# Altium schematic sheet BBB_Supply_2.SchDoc
size OrCAD A
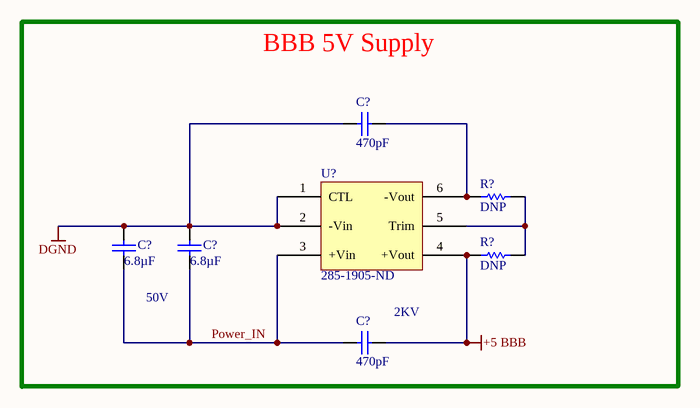
[diagram p0: BBB_Supply_2.SchDoc]

## Parts
(Parts that share a designator on the sheet are numbered #1, #2 ... from top to bottom, then left to right.)
C?#1  Capacitance: 470pF  [CAPC1206(3216)130_N]  (hidden comment: CAP CER 1UF 50V X7R 1210)
C?#2  Capacitance: 6.8µF  [CAPC1206(3216)130_N]  (hidden comment: CAP CER 1UF 50V X7R 1210)
C?#3  Capacitance: 6.8µF  [CAPC1206(3216)130_N]  (hidden comment: CAP CER 1UF 50V X7R 1210)
C?#4  Capacitance: 470pF  [CAPC1206(3216)130_N]  (hidden comment: CAP CER 1UF 50V X7R 1210)
R?#1  DNP  [RESC0402(1005)_L]
R?#2  DNP  [RESC0402(1005)_L]
U?  Supplier Part Number 1: 285-1905-ND  [PXB15-24WS05/NT]  (hidden comment: PXB15-24WS05/NT)

## Nets
+5 BBB: C?#4.1 R?#2.2 U?.4(+Vout)
DGND: C?#1.2 C?#2.2 C?#3.2 U?.1(CTL) U?.2(-Vin)
Power_IN: C?#2.1 C?#3.1 C?#4.2 U?.3(+Vin)
NetC?#1_1: C?#1.1 R?#1.2 U?.6(-Vout)
NetR?#1_1: R?#1.1 R?#2.1 U?.5(Trim)

## Notes on the sheet
- BBB 5V Supply
- (near C?#2) 50V
- (near C?#4) 2KV
- Title
- Size:
- Date:
- Orcad A
- Number:
- Time:
- Revision:
- Sheet
- of
- ZLS Corporation
- 7801 North Lamar Blvd.
- Suite E-184
- Austin, Texas 78752  USA
- (512) 453-0288
- File:

## Library data of the parts
C?#1-C?#4 = CMP-1037-04913-1: Manufacturer: Murata Electronics North America; Manufacturer Part Number: GRM32RR71H105KA01L; Tolerance: ±10%; Supplier 1: Digi-Key; Supplier Part Number 1: 490-1863-6-ND; RoHS: RoHS Compliant; Category: Capacitors; Stock 1: 66890; Pricing 1: 1=0.35, 10=0.242, 100=0.1449, 500=0.10868 (USD); Packaging: Digi-Reel®; Part Status: Active; Voltage - Rated: 50V; Temperature Coefficient: X7R; Operating Temperature: -55°C ~ 125°C; Features: -; Ratings: -; Applications: General Purpose; Mounting Type: Surface Mount, MLCC; Package / Case: 1210 (3225 Metric); Size / Dimension: 0.126" L x 0.098" W (3.20mm x 2.50mm); Height - Seated (Max): -; Thickness (Max): 0.079" (2.00mm); Lead Spacing: -; Lead Style: -; ComponentLink1URL: http://search.murata.co.jp/Ceramy/image/img/A01X/G101/ENG/GRM32RR71H105KA01-01.pdf; ComponentLink1Description: http://search.murata.co.jp/Ceramy/image/img/A01X/G101/ENG/GRM32RR71H105KA01-01.pdf
R?#1 R?#2 = CMP-1011-00927-1: TBD
U? = PXB15-24WS05/NT: Supplier 1: Digi-Key